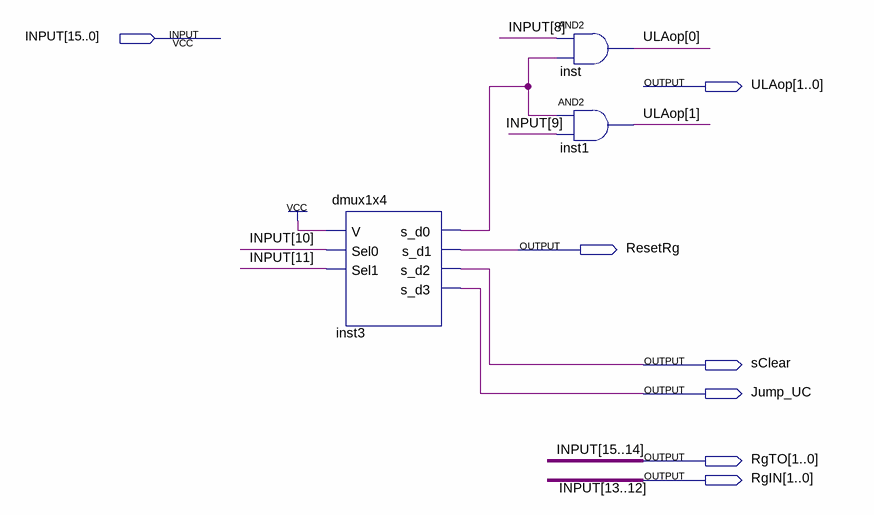
[diagram p0: schematic sheet]
// Quartus schematic UC.bdf as structural Verilog: 3 symbols, 7 pins
module UC (
  input  [15:0] INPUT,
  output [1:0] ULAop,
  output ResetRg,
  output sClear,
  output Jump_UC,
  output [1:0] RgTO,
  output [1:0] RgIN
);

  wire inst3_s_d0;

  dmux1x4 inst3 (
    .V(1'b1), .Sel0(INPUT[10]), .Sel1(INPUT[11]), .s_d0(inst3_s_d0), .s_d1(ResetRg), .s_d2(sClear),
    .s_d3(Jump_UC));
  and inst (ULAop[0], INPUT[8], inst3_s_d0);
  and inst1 (ULAop[1], inst3_s_d0, INPUT[9]);

  assign RgIN = INPUT[13:12];
  assign RgTO = INPUT[15:14];
endmodule
